# Altium schematic sheet Flash_Memory.SchDoc
size A4; DrawnBy: Santiago Rodriguez; DocumentNumber: 4; Revision: V1; SheetNumber: 5; SheetTotal: 10
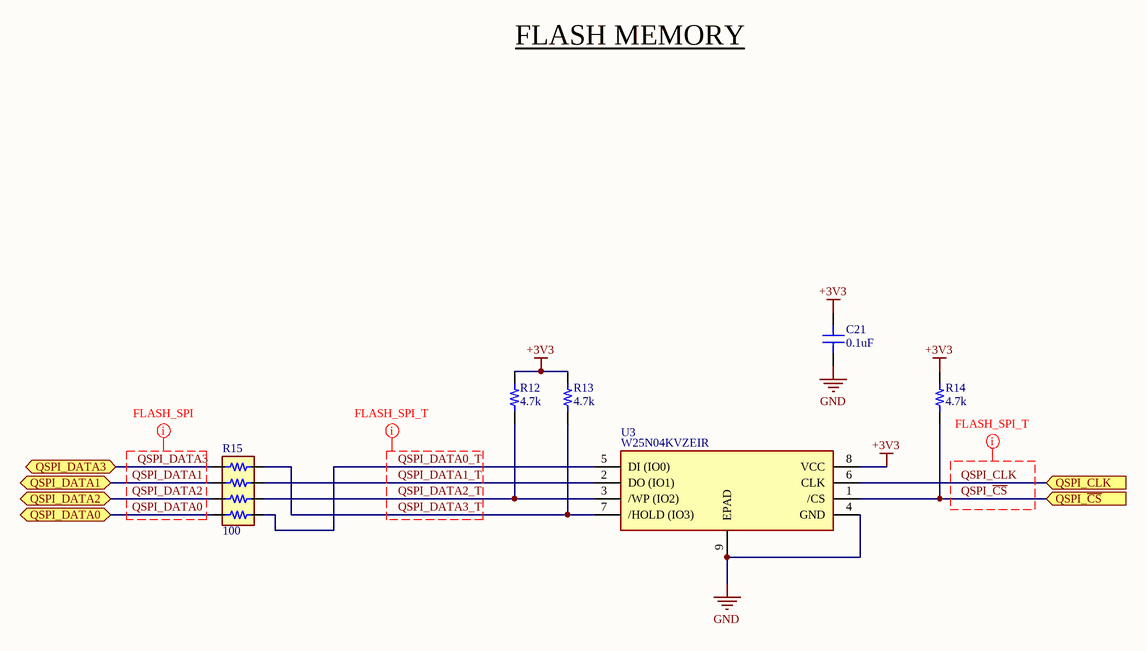
[diagram p0: Flash_Memory.SchDoc]

## Parts
C21  0.1uF  [CAP0402]
R12  4.7k  [RES0402]
R13  4.7k  [RES0402]
R14  4.7k  [RES0402]
R15  100  [ArrayResistor-1206]
U3  W25N04KVZEIR  [WSON-8]

## Ports
QSPI_CLK (in), QSPI_DATA0 (bidir), QSPI_DATA1 (bidir), QSPI_DATA2 (bidir), QSPI_DATA3 (bidir), QSPI_~{CS} (in)

## Nets
+3V3: C21.2 R12.2 R13.2 R14.2 U3.8(VCC)
GND: C21.1 U3.4(GND) U3.9(EPAD)
QSPI_~{CS}: R14.1 U3.1(/CS) ; port QSPI_~{CS}
QSPI_CLK: U3.6(CLK) ; port QSPI_CLK
QSPI_DATA0: R15.4 ; port QSPI_DATA0
QSPI_DATA0_T: R15.5 U3.5(DI_(IO0))
QSPI_DATA1: R15.2 ; port QSPI_DATA1
QSPI_DATA1_T: R15.7 U3.2(DO_(IO1))
QSPI_DATA2: R15.3 ; port QSPI_DATA2
QSPI_DATA2_T: R12.1 R15.6 U3.3(/WP_(IO2))
QSPI_DATA3: R15.1 ; port QSPI_DATA3
QSPI_DATA3_T: R13.1 R15.8 U3.7(/HOLD_(IO3))

## Layout directives
net class FLASH_SPI: QSPI_DATA0, QSPI_DATA1, QSPI_DATA2, QSPI_DATA3
net class FLASH_SPI_T: QSPI_CLK, QSPI_DATA0_T, QSPI_DATA1_T, QSPI_DATA2_T, QSPI_DATA3_T, QSPI_~{CS}

## Notes on the sheet
- FLASH MEMORY
- Proyect Name:
- Sheet Name:
- Drawn by:
- Revision:
- Sheet Number:
- Of
- Date:

## Library data of the parts
C21 = C0402C104K4RAC: CAP CER 0.1uF 16V X7R 0402 10%; Manufacturer: Kemet; ComponentLink1Description: DataSheet; ComponentLink1URL: https://content.kemet.com/datasheets/KEM_C1002_X7R_SMD.pdf; ComponentLink2Description: DigiKey; ComponentLink2URL: https://www.digikey.com/en/products/filter/ceramic-capacitors/60?s=N4IgTCBcDaIMIAYAsCxwIzINJIEoEE4QBdAXyA; Value: 0.1uF; Tolerance: 10%; Size: 0402; Voltage: 16V; PartNumber: C0402C104K4RAC
R12-R14 = CRCW04024K70FK: RES SMD 4.7K OHM 1% 0.063W 0402; Manufacturer: Vishay; ComponentLink1Description: DataSheet; ComponentLink1URL: https://www.vishay.com/docs/20035/dcrcwe3.pdf; Size: 0402; ComponentLink2Description: DigiKey; ComponentLink2URL: https://www.digikey.com/es/products/filter/resistor-de-chip-montaje-en-superficie/52?s=N4IgTCBcDaIMICU4HUAMAWVZ0GkDsqAYjiALoC%20QA; Power: 0.063 W; PartNumber: CRCW04024K70FK; Value: 4.7k; Tolerance: 1%
R15 = EXB-38V101JV: RES ARRAY 4 RES 100 OHM 1206; Manufacturer: Panasonic; Elements: 4; Value: 100 Ohms; ComponentLink1Description: DigiKey; ComponentLink1URL: https://www.digikey.com/en/products/detail/panasonic-electronic-components/EXB-38V101JV/256519?s=N4IgTCBcDaIKIA0BCBaAzADgGoEYAMOAUliALoC%2BQA; ComponentLink2Description: DataSheet; ComponentLink2URL: https://industrial.panasonic.com/cdbs/www-data/pdf/AOC0000/AOC0000C14.pdf; Size: 1206; PartNumber: EXB-38V101JV
U3 = W25N04KVZEIR: QSPINAND 4G-BIT FLASH MEMORY WITH DUAL/QUAD SPI BUFFER READ & SEQUENTIAL READ; Manufacturer: Winbond; ComponentLink1Description: Product Brief; ComponentLink1URL: https://www.winbond.com/hq/product/code-storage-flash-memory/qspinand-flash/?__locale=en&partNo=W25N04KV; Package: WSON-8; PartNumber: W25N04KVZEIR